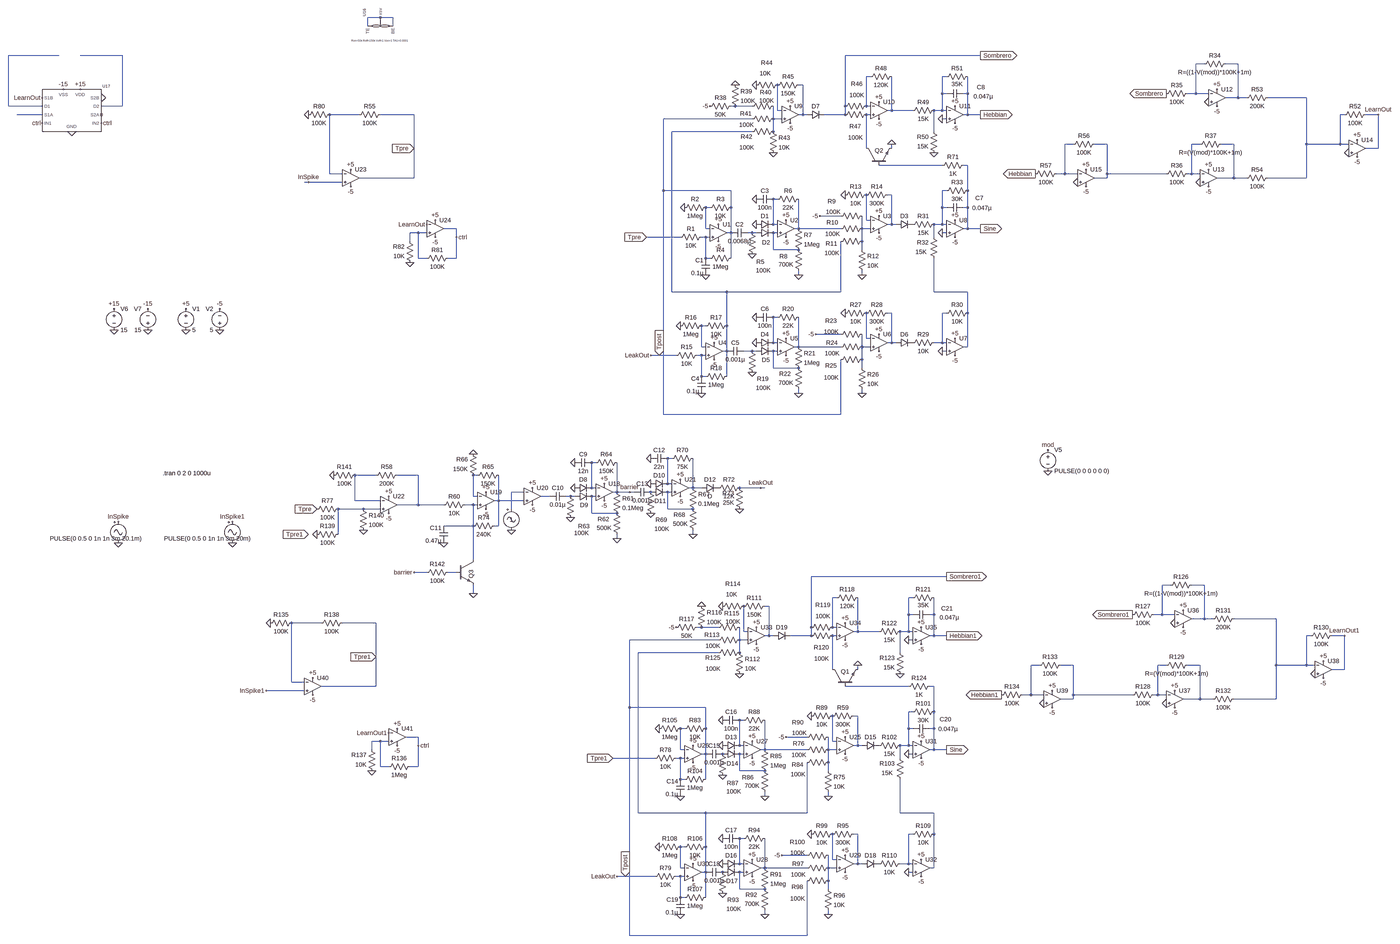
[diagram p0: schematic combined_schematicV2.asc, whole sheet]
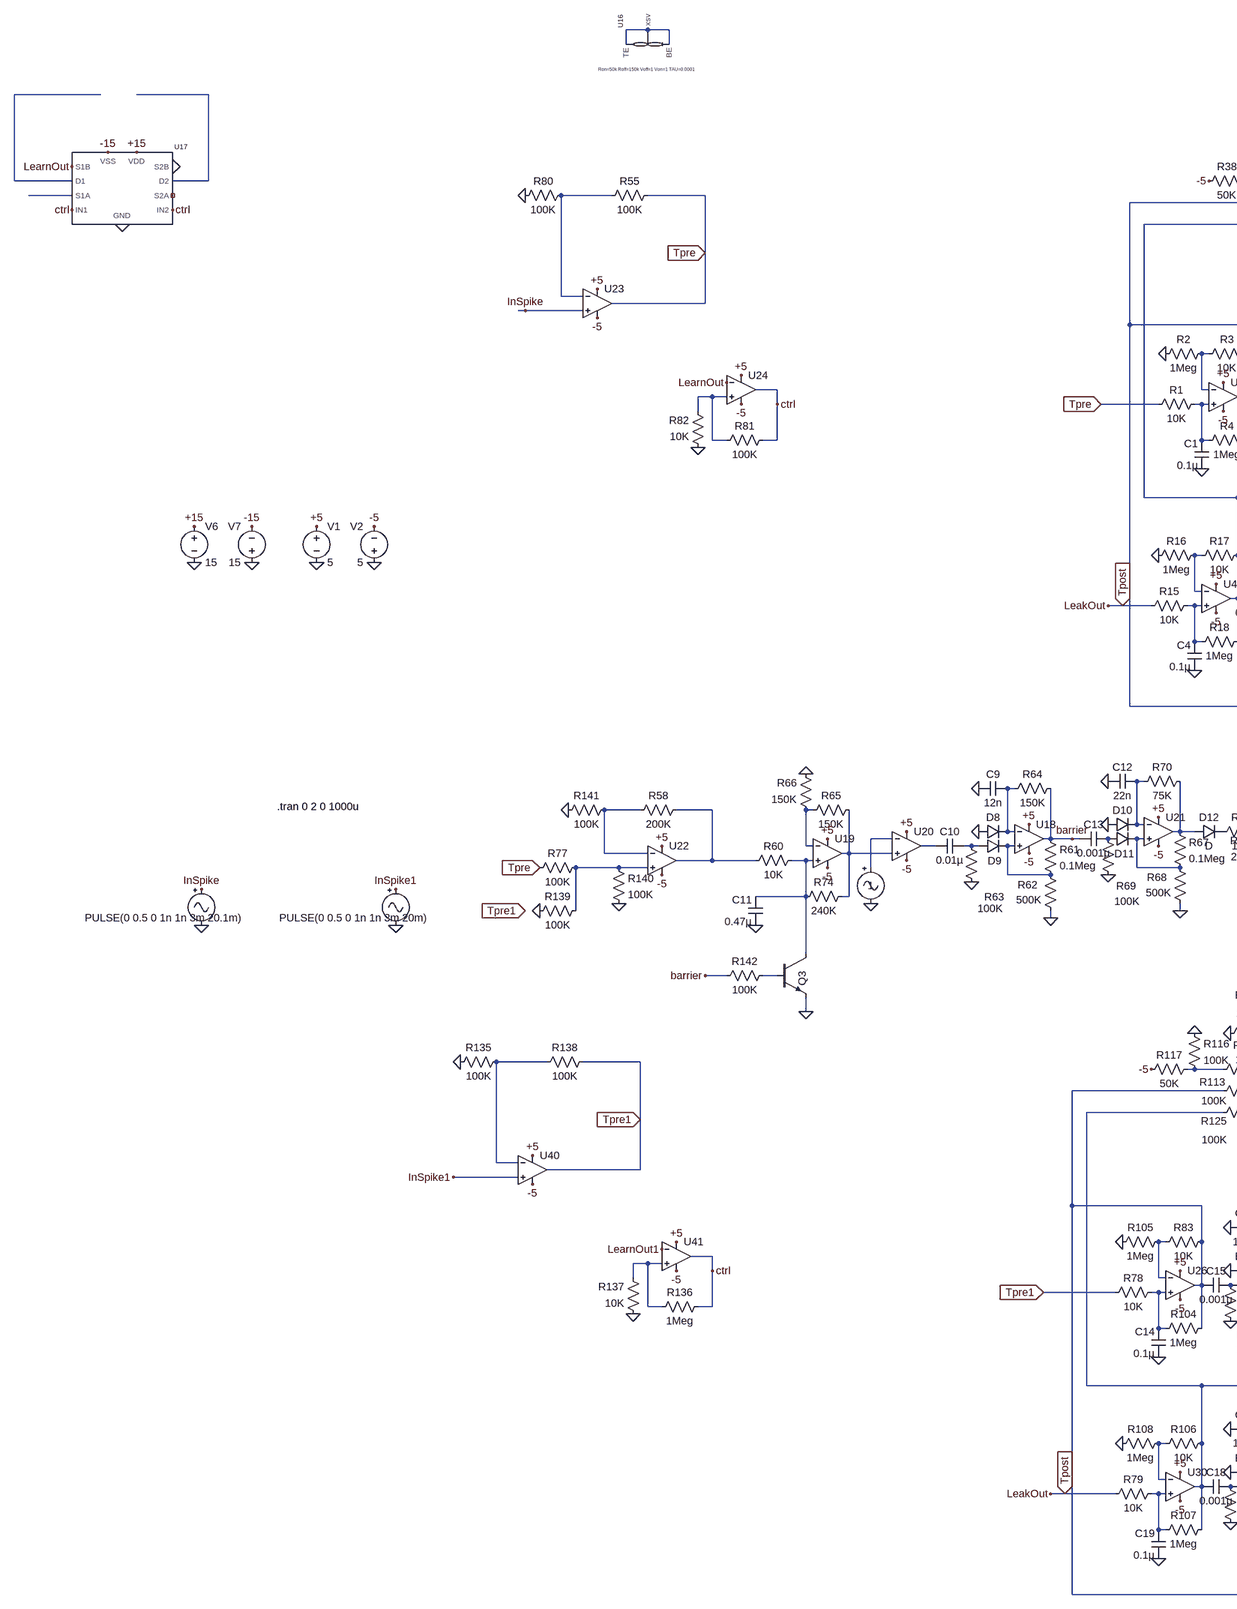
[diagram p1: schematic combined_schematicV2.asc, part, row 1 of 1, column 1 of 2]
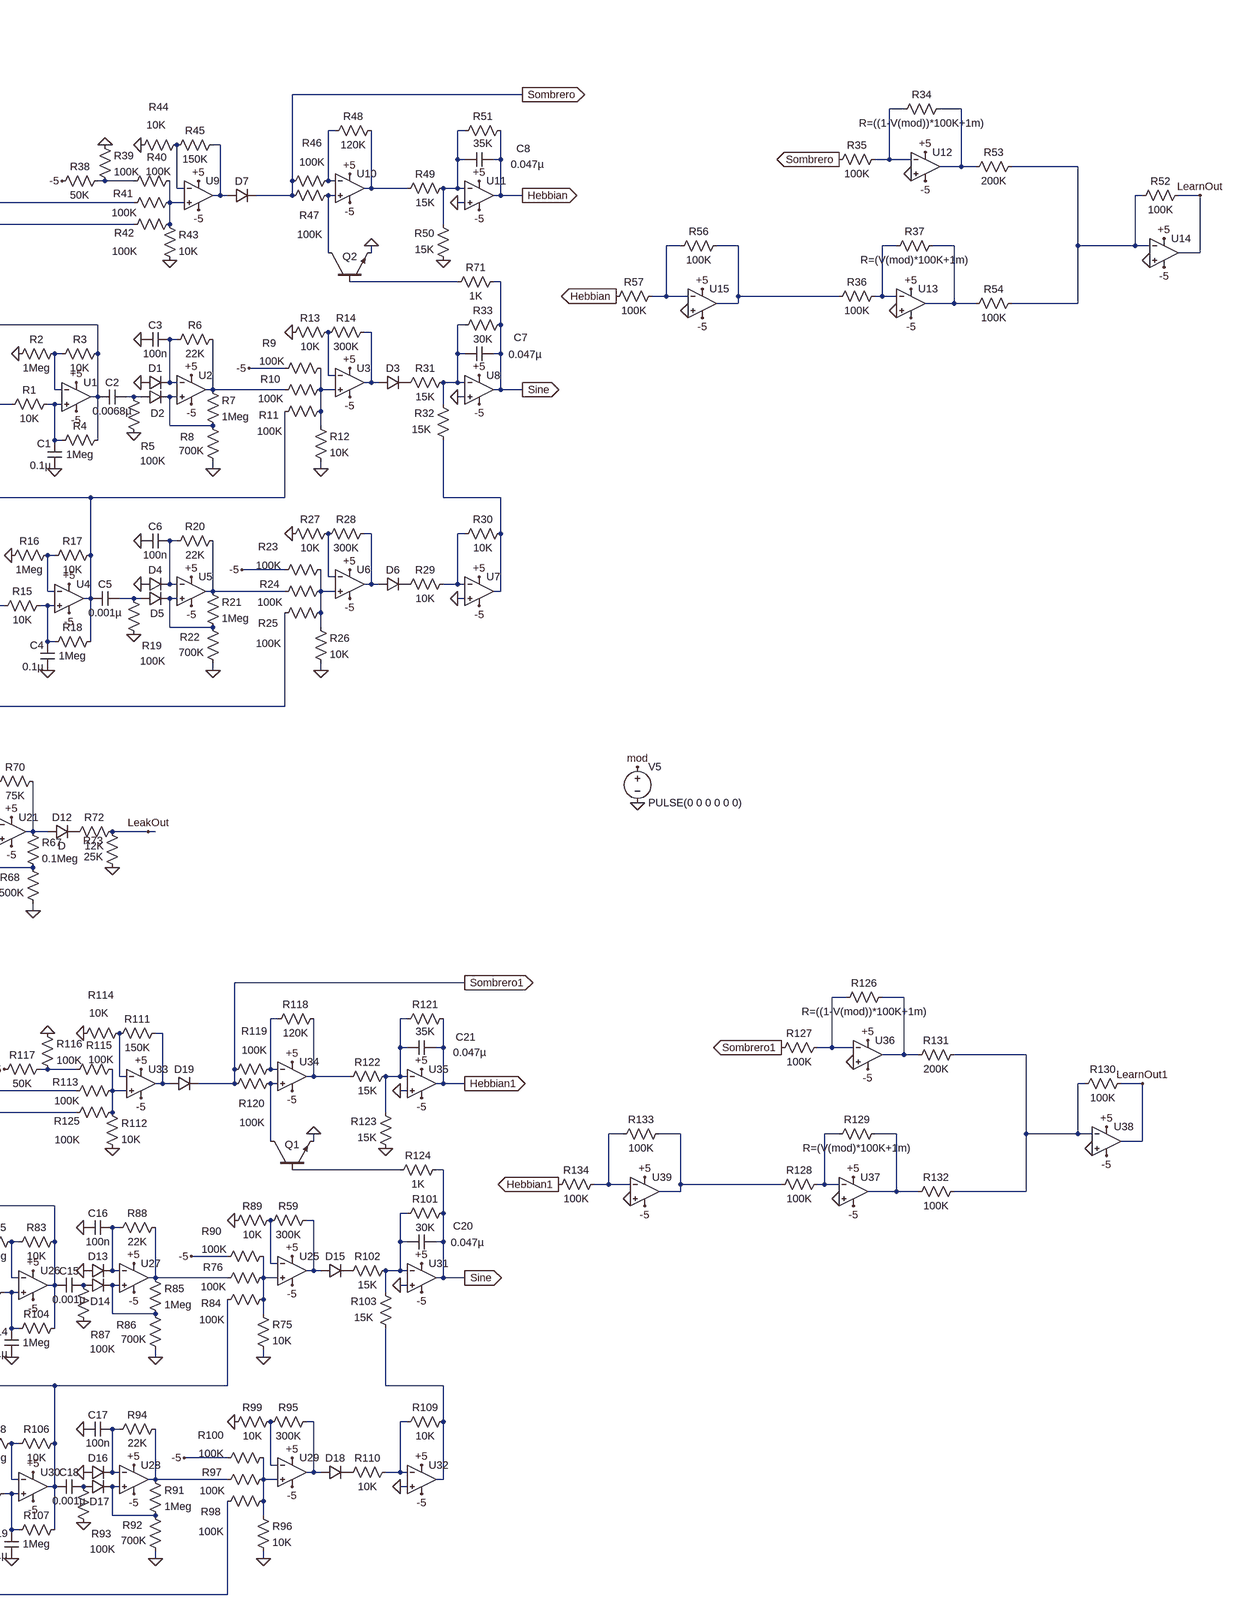
[diagram p2: schematic combined_schematicV2.asc, part, row 1 of 1, column 2 of 2]
combined_schematicV2.asc, the LTspice schematic file:
Version 4
SHEET 1 2784 2788
WIRE -1088 -816 -1136 -816
WIRE -1040 -816 -1088 -816
WIRE -1136 -784 -1136 -816
WIRE -1040 -784 -1040 -816
WIRE -2304 -672 -2496 -672
WIRE -2064 -672 -2224 -672
WIRE 1184 -672 672 -672
WIRE 2032 -640 2000 -640
WIRE 2160 -640 2112 -640
WIRE 768 -592 752 -592
WIRE 1056 -592 1040 -592
WIRE 512 -560 496 -560
WIRE 1040 -528 1040 -592
WIRE 1056 -528 1040 -528
WIRE 1136 -528 1136 -592
WIRE 1136 -528 1120 -528
WIRE 2000 -528 2000 -640
WIRE 2000 -528 1968 -528
WIRE 2048 -528 2000 -528
WIRE 2160 -512 2160 -640
WIRE 2160 -512 2112 -512
WIRE 2192 -512 2160 -512
WIRE 2432 -512 2272 -512
WIRE -2496 -480 -2496 -672
WIRE -2368 -480 -2496 -480
WIRE -2064 -480 -2064 -672
WIRE -2064 -480 -2144 -480
WIRE 256 -480 240 -480
WIRE 320 -480 256 -480
WIRE 672 -480 672 -672
WIRE 752 -480 752 -592
WIRE 768 -480 752 -480
WIRE 416 -464 416 -560
WIRE 432 -464 416 -464
WIRE 848 -464 848 -592
WIRE 848 -464 832 -464
WIRE 928 -464 848 -464
WIRE 1040 -464 1040 -528
WIRE 1040 -464 1008 -464
WIRE 1056 -464 1040 -464
WIRE -2368 -448 -2464 -448
WIRE -1168 -448 -1280 -448
WIRE -960 -448 -1088 -448
WIRE 512 -448 512 -560
WIRE 512 -448 496 -448
WIRE 528 -448 512 -448
WIRE 672 -448 672 -480
WIRE 672 -448 592 -448
WIRE 768 -448 752 -448
WIRE 1136 -448 1136 -528
WIRE 1136 -448 1120 -448
WIRE 1184 -448 1136 -448
WIRE 2576 -448 2560 -448
WIRE 2704 -448 2656 -448
WIRE 320 -432 -16 -432
WIRE 400 -432 400 -480
WIRE 432 -432 400 -432
WIRE 1056 -432 1040 -432
WIRE 320 -384 16 -384
WIRE 400 -384 400 -432
WIRE 1008 -384 1008 -464
WIRE 1536 -336 1504 -336
WIRE 1664 -336 1616 -336
WIRE 2016 -336 1984 -336
WIRE 2144 -336 2096 -336
WIRE 2432 -336 2432 -512
WIRE 2560 -336 2560 -448
WIRE 2560 -336 2432 -336
WIRE 2592 -336 2560 -336
WIRE -960 -320 -960 -448
WIRE 752 -320 752 -448
WIRE 848 -320 848 -336
WIRE 2704 -320 2704 -448
WIRE 2704 -320 2656 -320
WIRE 1040 -256 800 -256
WIRE 1136 -256 1120 -256
WIRE -1280 -224 -1280 -448
WIRE -1232 -224 -1280 -224
WIRE 1504 -224 1504 -336
WIRE 1504 -224 1472 -224
WIRE 1552 -224 1504 -224
WIRE 1664 -224 1664 -336
WIRE 1888 -224 1664 -224
WIRE 1984 -224 1984 -336
WIRE 1984 -224 1968 -224
WIRE 2016 -224 1984 -224
WIRE -960 -208 -960 -320
WIRE -960 -208 -1168 -208
WIRE 1664 -208 1664 -224
WIRE 1664 -208 1616 -208
WIRE 2144 -208 2144 -336
WIRE 2144 -208 2080 -208
WIRE 2192 -208 2144 -208
WIRE 2432 -208 2432 -336
WIRE 2432 -208 2272 -208
WIRE -1360 -192 -1376 -192
WIRE -1232 -192 -1360 -192
WIRE -16 -160 -16 -432
WIRE 240 -160 -16 -160
WIRE 1056 -160 1040 -160
WIRE 1136 -160 1136 -256
WIRE 848 -144 832 -144
WIRE 416 -128 400 -128
WIRE 160 -96 144 -96
WIRE 240 -96 240 -160
WIRE 1040 -96 1040 -160
WIRE 1056 -96 1040 -96
WIRE 1136 -96 1136 -160
WIRE 1136 -96 1120 -96
WIRE 656 -64 576 -64
WIRE 752 -48 752 -144
WIRE 768 -48 752 -48
WIRE 400 -32 400 -128
WIRE 416 -32 400 -32
WIRE 848 -32 848 -144
WIRE 848 -32 832 -32
WIRE 864 -32 848 -32
WIRE 1040 -32 1040 -96
WIRE 1040 -32 1008 -32
WIRE 1056 -32 1040 -32
WIRE -800 -16 -848 -16
WIRE 144 -16 144 -96
WIRE 160 -16 144 -16
WIRE 496 -16 496 -128
WIRE 496 -16 480 -16
WIRE 656 -16 496 -16
WIRE 736 -16 736 -64
WIRE 768 -16 736 -16
WIRE 1136 -16 1136 -96
WIRE 1136 -16 1120 -16
WIRE 1184 -16 1136 -16
WIRE -944 0 -976 0
WIRE -912 0 -944 0
WIRE 240 0 240 -96
WIRE 240 0 224 0
WIRE 320 0 304 0
WIRE 336 0 320 0
WIRE 416 0 400 0
WIRE 1056 0 1040 0
WIRE -800 16 -800 -16
WIRE 48 16 -80 16
WIRE 144 16 128 16
WIRE 160 16 144 16
WIRE 1008 16 1008 -32
WIRE -976 32 -976 0
WIRE 736 32 736 -16
WIRE 400 64 400 0
WIRE 496 64 400 64
WIRE 736 64 736 32
WIRE -944 96 -944 0
WIRE -912 96 -944 96
WIRE -800 96 -800 16
WIRE -800 96 -832 96
WIRE 144 96 144 16
WIRE 160 96 144 96
WIRE 240 96 240 0
WIRE 496 160 496 144
WIRE 736 160 736 144
WIRE 16 224 16 -384
WIRE 224 224 16 224
WIRE 656 224 656 32
WIRE 656 224 224 224
WIRE 1008 224 1008 96
WIRE 1136 224 1008 224
WIRE 848 304 832 304
WIRE 1056 304 1040 304
WIRE 1136 304 1136 224
WIRE 416 320 400 320
WIRE 144 352 128 352
WIRE 224 352 224 224
WIRE 656 384 560 384
WIRE 752 400 752 304
WIRE 768 400 752 400
WIRE 400 416 400 320
WIRE 416 416 400 416
WIRE 848 416 848 304
WIRE 848 416 832 416
WIRE 864 416 848 416
WIRE 1040 416 1040 304
WIRE 1040 416 1008 416
WIRE 1056 416 1040 416
WIRE 128 432 128 352
WIRE 144 432 128 432
WIRE 496 432 496 320
WIRE 496 432 480 432
WIRE 656 432 496 432
WIRE 736 432 736 384
WIRE 768 432 736 432
WIRE 1136 432 1136 304
WIRE 1136 432 1120 432
WIRE 224 448 224 352
WIRE 224 448 208 448
WIRE 320 448 288 448
WIRE 336 448 320 448
WIRE 416 448 400 448
WIRE 1056 448 1040 448
WIRE -32 464 -64 464
WIRE 32 464 -32 464
WIRE 128 464 112 464
WIRE 144 464 128 464
WIRE 736 480 736 432
WIRE 400 512 400 448
WIRE 496 512 400 512
WIRE 736 512 736 480
WIRE 128 544 128 464
WIRE 144 544 128 544
WIRE 224 544 224 448
WIRE 496 608 496 592
WIRE 736 608 736 592
WIRE -16 688 -16 -160
WIRE 656 688 656 480
WIRE 656 688 -16 688
WIRE 16 976 0 976
WIRE -272 992 -288 992
WIRE -1104 1040 -1184 1040
WIRE -944 1040 -1024 1040
WIRE -720 1040 -736 1040
WIRE 0 1072 0 976
WIRE 16 1072 0 1072
WIRE -288 1088 -288 992
WIRE -272 1088 -288 1088
WIRE 96 1088 96 976
WIRE 96 1088 80 1088
WIRE 128 1088 96 1088
WIRE 352 1088 272 1088
WIRE 368 1088 352 1088
WIRE -544 1104 -592 1104
WIRE -192 1104 -192 992
WIRE -192 1104 -208 1104
WIRE -144 1104 -192 1104
WIRE -128 1104 -144 1104
WIRE 16 1104 0 1104
WIRE -736 1120 -736 1040
WIRE -720 1120 -736 1120
WIRE -448 1120 -480 1120
WIRE -368 1120 -384 1120
WIRE -352 1120 -368 1120
WIRE -272 1120 -288 1120
WIRE -1184 1136 -1184 1040
WIRE -1088 1136 -1184 1136
WIRE -640 1136 -640 1040
WIRE -640 1136 -656 1136
WIRE -544 1136 -640 1136
WIRE -944 1152 -944 1040
WIRE -944 1152 -1024 1152
WIRE -848 1152 -944 1152
WIRE -736 1152 -768 1152
WIRE -720 1152 -736 1152
WIRE -1152 1168 -1248 1168
WIRE -1088 1168 -1152 1168
WIRE -592 1168 -592 1104
WIRE 0 1168 0 1104
WIRE 96 1168 0 1168
WIRE -288 1184 -288 1120
WIRE -192 1184 -288 1184
WIRE -736 1232 -736 1152
WIRE -736 1232 -848 1232
WIRE -640 1232 -640 1136
WIRE -640 1232 -656 1232
WIRE -1248 1264 -1248 1168
WIRE 96 1264 96 1248
WIRE -192 1280 -192 1264
WIRE -736 1360 -736 1232
WIRE -912 1408 -960 1408
WIRE -800 1408 -832 1408
WIRE 1056 1424 544 1424
WIRE 1904 1456 1872 1456
WIRE 2032 1456 1984 1456
WIRE -736 1488 -736 1456
WIRE 640 1504 624 1504
WIRE 928 1504 912 1504
WIRE 384 1536 368 1536
WIRE 912 1568 912 1504
WIRE 928 1568 912 1568
WIRE 1008 1568 1008 1504
WIRE 1008 1568 992 1568
WIRE 1872 1568 1872 1456
WIRE 1872 1568 1840 1568
WIRE 1920 1568 1872 1568
WIRE 2032 1584 2032 1456
WIRE 2032 1584 1984 1584
WIRE 2064 1584 2032 1584
WIRE 2304 1584 2144 1584
WIRE -1312 1600 -1424 1600
WIRE -1104 1600 -1232 1600
WIRE 128 1616 112 1616
WIRE 192 1616 128 1616
WIRE 544 1616 544 1424
WIRE 624 1616 624 1504
WIRE 640 1616 624 1616
WIRE 288 1632 288 1536
WIRE 304 1632 288 1632
WIRE 720 1632 720 1504
WIRE 720 1632 704 1632
WIRE 800 1632 720 1632
WIRE 912 1632 912 1568
WIRE 912 1632 880 1632
WIRE 928 1632 912 1632
WIRE 384 1648 384 1536
WIRE 384 1648 368 1648
WIRE 400 1648 384 1648
WIRE 544 1648 544 1616
WIRE 544 1648 464 1648
WIRE 640 1648 624 1648
WIRE 1008 1648 1008 1568
WIRE 1008 1648 992 1648
WIRE 1056 1648 1008 1648
WIRE 2448 1648 2432 1648
WIRE 2576 1648 2528 1648
WIRE 192 1664 -144 1664
WIRE 272 1664 272 1616
WIRE 304 1664 272 1664
WIRE 928 1664 912 1664
WIRE 192 1712 -112 1712
WIRE 272 1712 272 1664
WIRE 880 1712 880 1632
WIRE -1104 1728 -1104 1600
WIRE 1408 1760 1376 1760
WIRE 1536 1760 1488 1760
WIRE 1888 1760 1856 1760
WIRE 2016 1760 1968 1760
WIRE 2304 1760 2304 1584
WIRE 2432 1760 2432 1648
WIRE 2432 1760 2304 1760
WIRE 2464 1760 2432 1760
WIRE 624 1776 624 1648
WIRE 720 1776 720 1760
WIRE 2576 1776 2576 1648
WIRE 2576 1776 2528 1776
WIRE -1424 1824 -1424 1600
WIRE -1376 1824 -1424 1824
WIRE -1104 1840 -1104 1728
WIRE -1104 1840 -1312 1840
WIRE 912 1840 672 1840
WIRE 1008 1840 992 1840
WIRE -1376 1856 -1520 1856
WIRE 1376 1872 1376 1760
WIRE 1376 1872 1344 1872
WIRE 1424 1872 1376 1872
WIRE 1536 1872 1536 1760
WIRE 1760 1872 1536 1872
WIRE 1856 1872 1856 1760
WIRE 1856 1872 1840 1872
WIRE 1888 1872 1856 1872
WIRE 1536 1888 1536 1872
WIRE 1536 1888 1488 1888
WIRE 2016 1888 2016 1760
WIRE 2016 1888 1952 1888
WIRE 2064 1888 2016 1888
WIRE 2304 1888 2304 1760
WIRE 2304 1888 2144 1888
WIRE -144 1920 -144 1664
WIRE 144 1920 -144 1920
WIRE 928 1936 912 1936
WIRE 1008 1936 1008 1840
WIRE 720 1952 704 1952
WIRE 288 1968 272 1968
WIRE 64 2000 48 2000
WIRE 144 2000 144 1920
WIRE 912 2000 912 1936
WIRE 928 2000 912 2000
WIRE 1008 2000 1008 1936
WIRE 1008 2000 992 2000
WIRE -944 2032 -992 2032
WIRE 528 2032 448 2032
WIRE -1088 2048 -1120 2048
WIRE -1056 2048 -1088 2048
WIRE 624 2048 624 1952
WIRE 640 2048 624 2048
WIRE -944 2064 -944 2032
WIRE 272 2064 272 1968
WIRE 288 2064 272 2064
WIRE 720 2064 720 1952
WIRE 720 2064 704 2064
WIRE 736 2064 720 2064
WIRE 912 2064 912 2000
WIRE 912 2064 880 2064
WIRE 928 2064 912 2064
WIRE -1120 2080 -1120 2048
WIRE 48 2080 48 2000
WIRE 64 2080 48 2080
WIRE 368 2080 368 1968
WIRE 368 2080 352 2080
WIRE 528 2080 368 2080
WIRE 608 2080 608 2032
WIRE 640 2080 608 2080
WIRE 1008 2080 1008 2000
WIRE 1008 2080 992 2080
WIRE 1056 2080 1008 2080
WIRE 144 2096 144 2000
WIRE 144 2096 128 2096
WIRE 288 2096 272 2096
WIRE 928 2096 912 2096
WIRE -48 2112 -208 2112
WIRE 48 2112 32 2112
WIRE 64 2112 48 2112
WIRE 880 2112 880 2064
WIRE 608 2128 608 2080
WIRE -1088 2144 -1088 2048
WIRE -1056 2144 -1088 2144
WIRE -944 2144 -944 2064
WIRE -944 2144 -976 2144
WIRE 272 2160 272 2096
WIRE 368 2160 272 2160
WIRE 608 2160 608 2128
WIRE 48 2192 48 2112
WIRE 64 2192 48 2192
WIRE 144 2192 144 2096
WIRE 368 2256 368 2240
WIRE 608 2256 608 2240
WIRE -112 2320 -112 1712
WIRE 144 2320 -112 2320
WIRE 528 2320 528 2128
WIRE 528 2320 144 2320
WIRE 880 2320 880 2192
WIRE 1008 2320 880 2320
WIRE 720 2400 704 2400
WIRE 928 2400 912 2400
WIRE 1008 2400 1008 2320
WIRE 288 2416 272 2416
WIRE 64 2448 48 2448
WIRE 144 2448 144 2320
WIRE 528 2480 432 2480
WIRE 624 2496 624 2400
WIRE 640 2496 624 2496
WIRE 272 2512 272 2416
WIRE 288 2512 272 2512
WIRE 720 2512 720 2400
WIRE 720 2512 704 2512
WIRE 736 2512 720 2512
WIRE 912 2512 912 2400
WIRE 912 2512 880 2512
WIRE 928 2512 912 2512
WIRE 48 2528 48 2448
WIRE 64 2528 48 2528
WIRE 368 2528 368 2416
WIRE 368 2528 352 2528
WIRE 528 2528 368 2528
WIRE 608 2528 608 2480
WIRE 640 2528 608 2528
WIRE 1008 2528 1008 2400
WIRE 1008 2528 992 2528
WIRE 144 2544 144 2448
WIRE 144 2544 128 2544
WIRE 288 2544 272 2544
WIRE 928 2544 912 2544
WIRE -160 2560 -192 2560
WIRE -48 2560 -160 2560
WIRE 48 2560 32 2560
WIRE 64 2560 48 2560
WIRE 608 2576 608 2528
WIRE 272 2608 272 2544
WIRE 368 2608 272 2608
WIRE 608 2608 608 2576
WIRE 48 2640 48 2560
WIRE 64 2640 48 2640
WIRE 144 2640 144 2544
WIRE 368 2704 368 2688
WIRE 608 2704 608 2688
WIRE -144 2784 -144 1920
WIRE 528 2784 528 2576
WIRE 528 2784 -144 2784
FLAG 800 -64 +5
FLAG 800 0 -5
FLAG 192 -32 +5
FLAG 192 32 -5
FLAG 448 -48 +5
FLAG 448 16 -5
FLAG 336 -32 0
FLAG 336 -128 0
FLAG 320 80 0
FLAG 672 -144 0
FLAG 576 -64 -5
FLAG 448 400 +5
FLAG 448 464 -5
FLAG 336 416 0
FLAG 336 320 0
FLAG 320 528 0
FLAG 496 608 0
FLAG 496 160 0
FLAG 800 384 +5
FLAG 800 448 -5
FLAG 672 304 0
FLAG 560 384 -5
FLAG 144 160 0
FLAG 64 -96 0
FLAG 176 416 +5
FLAG 176 480 -5
FLAG 128 608 0
FLAG 48 352 0
FLAG 1088 -48 +5
FLAG 1088 16 -5
FLAG 1088 400 +5
FLAG 1088 464 -5
FLAG 1040 448 0
FLAG 1040 0 0
FLAG 736 160 0
FLAG 736 608 0
FLAG 1184 -16 Sine
IOPIN 1184 -16 Out
FLAG 464 -480 +5
FLAG 464 -416 -5
FLAG 336 -560 0
FLAG 256 -560 0
FLAG 800 -496 +5
FLAG 800 -432 -5
FLAG 160 -480 -5
FLAG 1088 -480 +5
FLAG 1088 -416 -5
FLAG 1040 -432 0
FLAG 1008 -304 0
FLAG 848 -336 0
FLAG 1184 -448 Hebbian
IOPIN 1184 -448 Out
FLAG 1184 -672 Sombrero
IOPIN 1184 -672 Out
FLAG -1824 368 0
FLAG -1696 368 0
FLAG -1696 288 -5
FLAG -1824 288 +5
FLAG -32 464 Tpost
IOPIN -32 464 In
FLAG -80 16 Tpre
IOPIN -80 16 In
FLAG 400 -304 0
FLAG 2048 -240 +5
FLAG 2048 -176 -5
FLAG 2080 -544 +5
FLAG 2080 -480 -5
FLAG 2048 -496 0
FLAG 2016 -192 0
FLAG 2624 -352 +5
FLAG 2624 -288 -5
FLAG 2592 -304 0
FLAG 1888 -528 Sombrero
IOPIN 1888 -528 Out
FLAG 1392 -224 Hebbian
IOPIN 1392 -224 Out
FLAG 1440 1024 0
FLAG 1440 944 mod
FLAG 2704 -448 LearnOut
FLAG 1584 -240 +5
FLAG 1584 -176 -5
FLAG 1552 -192 0
FLAG -2256 -384 0
FLAG -2080 1296 0
FLAG -240 1072 +5
FLAG -240 1136 -5
FLAG -352 1088 0
FLAG -352 992 0
FLAG -368 1200 0
FLAG -192 1280 0
FLAG -688 1104 +5
FLAG -688 1168 -5
FLAG -848 1296 0
FLAG -736 960 0
FLAG -512 1088 +5
FLAG -512 1152 -5
FLAG 48 1056 +5
FLAG 48 1120 -5
FLAG -64 1072 0
FLAG -64 976 0
FLAG -64 1184 0
FLAG 96 1264 0
FLAG 272 1168 0
FLAG -592 1248 0
FLAG -2096 368 0
FLAG -1968 368 0
FLAG -1968 288 -15
FLAG -2096 288 +15
FLAG -2224 -544 +15
FLAG -2288 -544 -15
FLAG 352 1088 LeakOut
FLAG -64 464 LeakOut
FLAG -1200 -240 +5
FLAG -1200 -176 -5
FLAG -1360 -192 InSpike
FLAG -1360 -448 0
FLAG -960 -320 Tpre
IOPIN -960 -320 In
FLAG -2144 -512 0
FLAG -1328 1168 Tpre
IOPIN -1328 1168 In
FLAG -2080 1216 InSpike
FLAG -2368 -512 LearnOut
FLAG -880 -48 +5
FLAG -912 -32 LearnOut
FLAG -976 112 0
FLAG -800 16 ctrl
FLAG -2368 -416 ctrl
FLAG -2144 -416 ctrl
FLAG -880 16 -5
FLAG -1056 1120 +5
FLAG -1056 1184 -5
FLAG -1264 1040 0
FLAG 672 2032 +5
FLAG 672 2096 -5
FLAG 96 2064 +5
FLAG 96 2128 -5
FLAG 320 2048 +5
FLAG 320 2112 -5
FLAG 208 2064 0
FLAG 208 1968 0
FLAG 208 2176 0
FLAG 544 1952 0
FLAG 448 2032 -5
FLAG 320 2496 +5
FLAG 320 2560 -5
FLAG 208 2512 0
FLAG 208 2416 0
FLAG 208 2624 0
FLAG 368 2704 0
FLAG 368 2256 0
FLAG 672 2480 +5
FLAG 672 2544 -5
FLAG 544 2400 0
FLAG 432 2480 -5
FLAG 48 2256 0
FLAG -32 2000 0
FLAG 96 2512 +5
FLAG 96 2576 -5
FLAG 48 2704 0
FLAG -32 2448 0
FLAG 960 2048 +5
FLAG 960 2112 -5
FLAG 960 2496 +5
FLAG 960 2560 -5
FLAG 912 2544 0
FLAG 912 2096 0
FLAG 608 2256 0
FLAG 608 2704 0
FLAG 1056 2080 Sine
IOPIN 1056 2080 Out
FLAG 336 1616 +5
FLAG 336 1680 -5
FLAG 208 1536 0
FLAG 128 1536 0
FLAG 672 1600 +5
FLAG 672 1664 -5
FLAG 32 1616 -5
FLAG 960 1616 +5
FLAG 960 1680 -5
FLAG 912 1664 0
FLAG 880 1792 0
FLAG 720 1760 0
FLAG 1056 1648 Hebbian1
IOPIN 1056 1648 Out
FLAG 1056 1424 Sombrero1
IOPIN 1056 1424 Out
FLAG -160 2560 Tpost
IOPIN -160 2560 In
FLAG -208 2112 Tpre1
IOPIN -208 2112 In
FLAG 272 1792 0
FLAG 1920 1856 +5
FLAG 1920 1920 -5
FLAG 1952 1552 +5
FLAG 1952 1616 -5
FLAG 1920 1600 0
FLAG 1888 1904 0
FLAG 2496 1744 +5
FLAG 2496 1808 -5
FLAG 2464 1792 0
FLAG 1760 1568 Sombrero1
IOPIN 1760 1568 Out
FLAG 1264 1872 Hebbian1
IOPIN 1264 1872 Out
FLAG 2576 1648 LearnOut1
FLAG 1456 1856 +5
FLAG 1456 1920 -5
FLAG 1424 1904 0
FLAG -192 2560 LeakOut
FLAG -1648 1296 0
FLAG -1344 1808 +5
FLAG -1344 1872 -5
FLAG -1520 1856 InSpike1
FLAG -1504 1600 0
FLAG -1104 1728 Tpre1
IOPIN -1104 1728 In
FLAG -1648 1216 InSpike1
FLAG -1024 2000 +5
FLAG -1056 2016 LearnOut1
FLAG -1120 2160 0
FLAG -944 2064 ctrl
FLAG -1024 2064 -5
FLAG -1360 1264 Tpre1
IOPIN -1360 1264 In
FLAG -1152 1248 0
FLAG -736 1488 0
FLAG -144 1104 barrier
FLAG -960 1408 barrier
FLAG -1328 1264 0
SYMBOL Opamps\\UniversalOpamp2 800 -32 R0
SYMATTR InstName U3
SYMBOL res 848 -160 R90
WINDOW 0 0 56 VBottom 2
WINDOW 3 32 56 VTop 2
SYMATTR InstName R14
SYMATTR Value 300K
SYMBOL res 720 48 R0
SYMATTR InstName R12
SYMATTR Value 10K
SYMBOL res 752 -32 R90
WINDOW 0 8 128 VBottom 2
WINDOW 3 20 127 VTop 2
SYMATTR InstName R10
SYMATTR Value 100K
SYMBOL Opamps\\UniversalOpamp2 192 0 R0
SYMATTR InstName U1
SYMBOL cap 160 160 R180
WINDOW 0 24 56 Left 2
WINDOW 3 24 8 Left 2
SYMATTR InstName C1
SYMATTR Value 0.1µ
SYMBOL res 144 0 R90
WINDOW 0 0 56 VBottom 2
WINDOW 3 32 56 VTop 2
SYMATTR InstName R1
SYMATTR Value 10K
SYMBOL res 128 448 R90
WINDOW 0 0 56 VBottom 2
WINDOW 3 32 56 VTop 2
SYMATTR InstName R15
SYMATTR Value 10K
SYMBOL res 256 -112 R90
WINDOW 0 0 56 VBottom 2
WINDOW 3 32 56 VTop 2
SYMATTR InstName R3
SYMATTR Value 10K
SYMBOL res 752 16 R90
WINDOW 0 40 132 VBottom 2
WINDOW 3 45 130 VTop 2
SYMATTR InstName R11
SYMATTR Value 100K
SYMBOL Opamps\\UniversalOpamp2 448 -16 R0
SYMATTR InstName U2
SYMBOL diode 336 -16 R270
WINDOW 0 32 32 VTop 2
WINDOW 3 0 32 Invisible 2
SYMATTR InstName D1
SYMBOL diode 336 16 R270
WINDOW 0 -36 37 VTop 2
WINDOW 3 0 32 Invisible 2
SYMATTR InstName D2
SYMBOL res 480 -32 R0
SYMATTR InstName R7
SYMATTR Value 1Meg
SYMBOL res 512 160 R180
WINDOW 0 58 71 Left 2
WINDOW 3 36 40 Left 2
SYMATTR InstName R8
SYMATTR Value 700K
SYMBOL res 304 -16 R0
WINDOW 0 32 126 Left 2
WINDOW 3 30 158 Left 2
SYMATTR InstName R5
SYMATTR Value 100K
SYMBOL cap 304 -16 R90
WINDOW 0 0 32 VBottom 2
WINDOW 3 32 32 VTop 2
SYMATTR InstName C2
SYMATTR Value 0.0068µ
SYMBOL res 512 -144 R90
WINDOW 0 0 56 VBottom 2
WINDOW 3 32 56 VTop 2
SYMATTR InstName R6
SYMATTR Value 22K
SYMBOL cap 400 -144 R90
WINDOW 0 0 32 VBottom 2
WINDOW 3 32 32 VTop 2
SYMATTR InstName C3
SYMATTR Value 100n
SYMBOL res 656 -128 R270
WINDOW 0 32 56 VTop 2
WINDOW 3 0 56 VBottom 2
SYMATTR InstName R13
SYMATTR Value 10K
SYMBOL diode 864 -16 R270
WINDOW 0 32 32 VTop 2
WINDOW 3 0 32 Invisible 2
SYMATTR InstName D3
SYMBOL res 752 -80 R90
WINDOW 0 -24 131 VBottom 2
WINDOW 3 -15 125 VTop 2
SYMATTR InstName R9
SYMATTR Value 100K
SYMBOL Opamps\\UniversalOpamp2 448 432 R0
SYMATTR InstName U5
SYMBOL diode 336 432 R270
WINDOW 0 32 32 VTop 2
WINDOW 3 0 32 Invisible 2
SYMATTR InstName D4
SYMBOL diode 336 464 R270
WINDOW 0 -33 36 VTop 2
WINDOW 3 0 32 Invisible 2
SYMATTR InstName D5
SYMBOL res 480 416 R0
SYMATTR InstName R21
SYMATTR Value 1Meg
SYMBOL res 512 608 R180
WINDOW 0 45 74 Left 2
WINDOW 3 36 40 Left 2
SYMATTR InstName R22
SYMATTR Value 700K
SYMBOL res 304 432 R0
WINDOW 0 34 121 Left 2
WINDOW 3 30 155 Left 2
SYMATTR InstName R19
SYMATTR Value 100K
SYMBOL res 512 304 R90
WINDOW 0 0 56 VBottom 2
WINDOW 3 32 56 VTop 2
SYMATTR InstName R20
SYMATTR Value 22K
SYMBOL cap 400 304 R90
WINDOW 0 0 32 VBottom 2
WINDOW 3 32 32 VTop 2
SYMATTR InstName C6
SYMATTR Value 100n
SYMBOL cap 288 432 R90
WINDOW 0 0 32 VBottom 2
WINDOW 3 32 32 VTop 2
SYMATTR InstName C5
SYMATTR Value 0.001µ
SYMBOL Opamps\\UniversalOpamp2 800 416 R0
SYMATTR InstName U6
SYMBOL res 848 288 R90
WINDOW 0 0 56 VBottom 2
WINDOW 3 32 56 VTop 2
SYMATTR InstName R28
SYMATTR Value 300K
SYMBOL res 720 496 R0
SYMATTR InstName R26
SYMATTR Value 10K
SYMBOL res 752 416 R90
WINDOW 0 16 130 VBottom 2
WINDOW 3 25 129 VTop 2
SYMATTR InstName R24
SYMATTR Value 100K
SYMBOL res 752 464 R90
WINDOW 0 55 133 VBottom 2
WINDOW 3 68 132 VTop 2
SYMATTR InstName R25
SYMATTR Value 100K
SYMBOL res 656 320 R270
WINDOW 0 32 56 VTop 2
WINDOW 3 0 56 VBottom 2
SYMATTR InstName R27
SYMATTR Value 10K
SYMBOL diode 864 432 R270
WINDOW 0 32 32 VTop 2
WINDOW 3 0 32 Invisible 2
SYMATTR InstName D6
SYMBOL res 752 368 R90
WINDOW 0 -19 133 VBottom 2
WINDOW 3 -9 132 VTop 2
SYMATTR InstName R23
SYMATTR Value 100K
SYMBOL res 1152 -176 R90
WINDOW 0 0 56 VBottom 2
WINDOW 3 32 56 VTop 2
SYMATTR InstName R33
SYMATTR Value 30K
SYMBOL res 1024 -48 R90
WINDOW 0 0 56 VBottom 2
WINDOW 3 32 56 VTop 2
SYMATTR InstName R31
SYMATTR Value 15K
SYMBOL res 1024 112 R180
WINDOW 0 36 76 Left 2
WINDOW 3 43 40 Left 2
SYMATTR InstName R32
SYMATTR Value 15K
SYMBOL res 256 80 R90
WINDOW 0 0 56 VBottom 2
WINDOW 3 32 56 VTop 2
SYMATTR InstName R4
SYMATTR Value 1Meg
SYMBOL res 160 -112 R90
WINDOW 0 0 56 VBottom 2
WINDOW 3 32 56 VTop 2
SYMATTR InstName R2
SYMATTR Value 1Meg
SYMBOL Opamps\\UniversalOpamp2 176 448 R0
SYMATTR InstName U4
SYMBOL cap 144 608 R180
WINDOW 0 24 56 Left 2
WINDOW 3 24 8 Left 2
SYMATTR InstName C4
SYMATTR Value 0.1µ
SYMBOL res 240 336 R90
WINDOW 0 0 56 VBottom 2
WINDOW 3 32 56 VTop 2
SYMATTR InstName R17
SYMATTR Value 10K
SYMBOL res 240 528 R90
WINDOW 0 0 56 VBottom 2
WINDOW 3 32 56 VTop 2
SYMATTR InstName R18
SYMATTR Value 1Meg
SYMBOL res 144 336 R90
WINDOW 0 0 56 VBottom 2
WINDOW 3 32 56 VTop 2
SYMATTR InstName R16
SYMATTR Value 1Meg
SYMBOL Opamps\\UniversalOpamp2 1088 -16 R0
SYMATTR InstName U8
SYMBOL res 1152 288 R90
WINDOW 0 0 56 VBottom 2
WINDOW 3 32 56 VTop 2
SYMATTR InstName R30
SYMATTR Value 10K
SYMBOL Opamps\\UniversalOpamp2 1088 432 R0
SYMATTR InstName U7
SYMBOL res 1024 400 R90
WINDOW 0 0 56 VBottom 2
WINDOW 3 32 56 VTop 2
SYMATTR InstName R29
SYMATTR Value 10K
SYMBOL cap 1120 -112 R90
WINDOW 0 -4 -60 VBottom 2
WINDOW 3 2 -70 VTop 2
SYMATTR InstName C7
SYMATTR Value 0.047µ
SYMBOL Opamps\\UniversalOpamp2 464 -448 R0
SYMATTR InstName U9
SYMBOL res 512 -576 R90
WINDOW 0 0 56 VBottom 2
WINDOW 3 32 56 VTop 2
SYMATTR InstName R45
SYMATTR Value 150K
SYMBOL res 384 -400 R0
SYMATTR InstName R43
SYMATTR Value 10K
SYMBOL res 416 -448 R90
WINDOW 0 12 120 VBottom 2
WINDOW 3 23 117 VTop 2
SYMATTR InstName R41
SYMATTR Value 100K
SYMBOL res 320 -544 R270
WINDOW 0 85 55 VTop 2
WINDOW 3 76 50 VBottom 2
SYMATTR InstName R44
SYMATTR Value 10K
SYMBOL res 416 -496 R90
WINDOW 0 -21 45 VBottom 2
WINDOW 3 -21 41 VTop 2
SYMATTR InstName R40
SYMATTR Value 100K
SYMBOL res 240 -576 R0
SYMATTR InstName R39
SYMATTR Value 100K
SYMBOL res 256 -496 R90
WINDOW 0 0 56 VBottom 2
WINDOW 3 32 56 VTop 2
SYMATTR InstName R38
SYMATTR Value 50K
SYMBOL diode 528 -432 R270
WINDOW 0 32 32 VTop 2
WINDOW 3 0 32 Invisible 2
SYMATTR InstName D7
SYMBOL res 864 -608 R90
WINDOW 0 0 56 VBottom 2
WINDOW 3 32 56 VTop 2
SYMATTR InstName R48
SYMATTR Value 120K
SYMBOL Opamps\\UniversalOpamp2 800 -464 R0
SYMATTR InstName U10
SYMBOL res 768 -496 R90
WINDOW 0 -53 52 VBottom 2
WINDOW 3 -42 52 VTop 2
SYMATTR InstName R46
SYMATTR Value 100K
SYMBOL res 768 -464 R90
WINDOW 0 76 58 VBottom 2
WINDOW 3 87 57 VTop 2
SYMATTR InstName R47
SYMATTR Value 100K
SYMBOL npn 752 -256 R270
WINDOW 0 56 32 VRight 2
WINDOW 3 56 68 Invisible 2
SYMATTR InstName Q2
SYMBOL res 1152 -608 R90
WINDOW 0 0 56 VBottom 2
WINDOW 3 60 56 VBottom 2
SYMATTR InstName R51
SYMATTR Value 35K
SYMBOL res 1024 -480 R90
WINDOW 0 0 56 VBottom 2
WINDOW 3 32 56 VTop 2
SYMATTR InstName R49
SYMATTR Value 15K
SYMBOL res 1024 -288 R180
WINDOW 0 36 76 Left 2
WINDOW 3 36 40 Left 2
SYMATTR InstName R50
SYMATTR Value 15K
SYMBOL Opamps\\UniversalOpamp2 1088 -448 R0
SYMATTR InstName U11
SYMBOL cap 1120 -544 R90
WINDOW 0 8 -66 VBottom 2
WINDOW 3 11 -75 VTop 2
SYMATTR InstName C8
SYMATTR Value 0.047µ
SYMBOL res 1024 -240 R270
WINDOW 0 32 56 VTop 2
WINDOW 3 0 56 VBottom 2
SYMATTR InstName R71
SYMATTR Value 1K
SYMBOL voltage -1824 272 R0
WINDOW 123 0 0 Left 2
WINDOW 39 0 0 Left 2
SYMATTR InstName V1
SYMATTR Value 5
SYMBOL voltage -1696 384 R180
WINDOW 0 24 96 Left 2
WINDOW 3 24 16 Left 2
WINDOW 123 0 0 Left 2
WINDOW 39 0 0 Left 2
SYMATTR InstName V2
SYMATTR Value 5
SYMBOL res 416 -400 R90
WINDOW 0 51 117 VBottom 2
WINDOW 3 61 116 VTop 2
SYMATTR InstName R42
SYMATTR Value 100K
SYMBOL Opamps\\UniversalOpamp2 2080 -512 R0
SYMATTR InstName U12
SYMBOL Opamps\\UniversalOpamp2 2048 -208 R0
SYMATTR InstName U13
SYMBOL res 2128 -656 R90
WINDOW 0 0 56 VBottom 2
WINDOW 3 32 56 VTop 2
SYMATTR InstName R34
SYMATTR Value R=((1-V(mod))*100K+1m)
SYMBOL res 1984 -544 R90
WINDOW 0 0 56 VBottom 2
WINDOW 3 32 56 VTop 2
SYMATTR InstName R35
SYMATTR Value 100K
SYMBOL res 1984 -240 R90
WINDOW 0 0 56 VBottom 2
WINDOW 3 32 56 VTop 2
SYMATTR InstName R36
SYMATTR Value 100K
SYMBOL res 2112 -352 R90
WINDOW 0 0 56 VBottom 2
WINDOW 3 32 56 VTop 2
SYMATTR InstName R37
SYMATTR Value R=(V(mod)*100K+1m)
SYMBOL Opamps\\UniversalOpamp2 2624 -320 R0
SYMATTR InstName U14
SYMBOL res 2672 -464 R90
WINDOW 0 0 56 VBottom 2
WINDOW 3 32 56 VTop 2
SYMATTR InstName R52
SYMATTR Value 100K
SYMBOL res 2288 -528 R90
WINDOW 0 0 56 VBottom 2
WINDOW 3 32 56 VTop 2
SYMATTR InstName R53
SYMATTR Value 200K
SYMBOL res 2288 -224 R90
WINDOW 0 0 56 VBottom 2
WINDOW 3 32 56 VTop 2
SYMATTR InstName R54
SYMATTR Value 100K
SYMBOL voltage 1440 928 R0
WINDOW 123 0 0 Left 2
WINDOW 39 0 0 Left 2
SYMATTR InstName V5
SYMATTR Value PULSE(0 0 0 0 0 0)
SYMBOL Opamps\\UniversalOpamp2 1584 -208 R0
SYMATTR InstName U15
SYMBOL res 1632 -352 R90
WINDOW 0 0 56 VBottom 2
WINDOW 3 32 56 VTop 2
SYMATTR InstName R56
SYMATTR Value 100K
SYMBOL res 1488 -240 R90
WINDOW 0 0 56 VBottom 2
WINDOW 3 32 56 VTop 2
SYMATTR InstName R57
SYMATTR Value 100K
SYMBOL memristor_with_state -1088 -784 R270
WINDOW 3 -56 -110 VRight 0
SYMATTR Value Ron=50k Roff=150k Voff=1 Von=1 TAU=0.0001
SYMATTR SpiceModel MEM_KNOWM
SYMATTR InstName U16
SYMBOL res -752 1136 R90
WINDOW 0 0 56 VBottom 2
WINDOW 3 32 56 VTop 2
SYMATTR InstName R60
SYMATTR Value 10K
SYMBOL Opamps\\UniversalOpamp2 -240 1104 R0
SYMATTR InstName U18
SYMBOL diode -352 1104 R270
WINDOW 0 32 32 VTop 2
WINDOW 3 0 32 Invisible 2
SYMATTR InstName D8
SYMBOL diode -352 1136 R270
WINDOW 0 -33 36 VTop 2
WINDOW 3 0 32 Invisible 2
SYMATTR InstName D9
SYMBOL res -208 1088 R0
SYMATTR InstName R61
SYMATTR Value 0.1Meg
SYMBOL res -176 1280 R180
WINDOW 0 45 74 Left 2
WINDOW 3 36 40 Left 2
SYMATTR InstName R62
SYMATTR Value 500K
SYMBOL res -384 1104 R0
WINDOW 0 45 129 Left 2
WINDOW 3 30 155 Left 2
SYMATTR InstName R63
SYMATTR Value 100K
SYMBOL res -176 976 R90
WINDOW 0 0 56 VBottom 2
WINDOW 3 32 56 VTop 2
SYMATTR InstName R64
SYMATTR Value 150K
SYMBOL cap -288 976 R90
WINDOW 0 0 32 VBottom 2
WINDOW 3 32 32 VTop 2
SYMATTR InstName C9
SYMATTR Value 12n
SYMBOL cap -384 1104 R90
WINDOW 0 0 32 VBottom 2
WINDOW 3 32 32 VTop 2
SYMATTR InstName C10
SYMATTR Value 0.01µ
SYMBOL Opamps\\UniversalOpamp2 -688 1136 R0
SYMATTR InstName U19
SYMBOL cap -832 1296 R180
WINDOW 0 24 56 Left 2
WINDOW 3 24 8 Left 2
SYMATTR InstName C11
SYMATTR Value 0.47µ
SYMBOL res -624 1024 R90
WINDOW 0 0 56 VBottom 2
WINDOW 3 32 56 VTop 2
SYMATTR InstName R65
SYMATTR Value 150K
SYMBOL res -720 1056 R180
WINDOW 0 36 76 Left 2
WINDOW 3 36 40 Left 2
SYMATTR InstName R66
SYMATTR Value 150K
SYMBOL Misc\\signal -2080 1200 R0
WINDOW 0 24 16 Invisible 2
WINDOW 3 -259 80 Left 2
WINDOW 123 0 0 Left 2
WINDOW 39 0 0 Left 2
SYMATTR InstName V8
SYMATTR Value PULSE(0 0.5 0 1n 1n 3m 20.1m)
SYMBOL Opamps\\UniversalOpamp2 -512 1120 R0
SYMATTR InstName U20
SYMBOL Opamps\\UniversalOpamp2 48 1088 R0
SYMATTR InstName U21
SYMBOL diode -64 1088 R270
WINDOW 0 32 32 VTop 2
WINDOW 3 0 32 Invisible 2
SYMATTR InstName D10
SYMBOL diode -64 1120 R270
WINDOW 0 -33 36 VTop 2
WINDOW 3 0 32 Invisible 2
SYMATTR InstName D11
SYMBOL res 80 1072 R0
SYMATTR InstName R67
SYMATTR Value 0.1Meg
SYMBOL res 112 1264 R180
WINDOW 0 45 74 Left 2
WINDOW 3 36 40 Left 2
SYMATTR InstName R68
SYMATTR Value 500K
SYMBOL res -80 1088 R0
WINDOW 0 34 121 Left 2
WINDOW 3 30 155 Left 2
SYMATTR InstName R69
SYMATTR Value 100K
SYMBOL res 112 960 R90
WINDOW 0 0 56 VBottom 2
WINDOW 3 32 56 VTop 2
SYMATTR InstName R70
SYMATTR Value 75K
SYMBOL cap 0 960 R90
WINDOW 0 0 32 VBottom 2
WINDOW 3 32 32 VTop 2
SYMATTR InstName C12
SYMATTR Value 22n
SYMBOL cap -64 1088 R90
WINDOW 0 0 32 VBottom 2
WINDOW 3 32 32 VTop 2
SYMATTR InstName C13
SYMATTR Value 0.001µ
SYMBOL diode 128 1104 R270
WINDOW 0 32 32 VTop 2
WINDOW 3 0 32 VBottom 2
SYMATTR InstName D12
SYMBOL res 288 1072 R90
WINDOW 0 0 56 VBottom 2
WINDOW 3 32 56 VTop 2
SYMATTR InstName R72
SYMATTR Value 12K
SYMBOL res 288 1184 R180
WINDOW 0 36 76 Left 2
WINDOW 3 36 40 Left 2
SYMATTR InstName R73
SYMATTR Value 25K
SYMBOL res -640 1216 R90
WINDOW 0 0 56 VBottom 2
WINDOW 3 32 56 VTop 2
SYMATTR InstName R74
SYMATTR Value 240K
SYMBOL Misc\\signal -592 1152 R0
WINDOW 0 24 16 Invisible 2
WINDOW 3 0 56 Center 2
WINDOW 123 0 0 Left 2
WINDOW 39 0 0 Left 2
SYMATTR InstName V9
SYMATTR Value 1
SYMBOL res -1232 1152 R90
WINDOW 0 0 56 VBottom 2
WINDOW 3 32 56 VTop 2
SYMATTR InstName R77
SYMATTR Value 100K
SYMBOL Memristive_brain\\ADG1236 -2256 -464 R0
SYMATTR InstName U17
SYMBOL voltage -2096 272 R0
WINDOW 123 0 0 Left 2
WINDOW 39 0 0 Left 2
SYMATTR InstName V6
SYMATTR Value 15
SYMBOL voltage -1968 384 R180
WINDOW 0 24 96 Left 2
WINDOW 3 24 16 Left 2
WINDOW 123 0 0 Left 2
WINDOW 39 0 0 Left 2
SYMATTR InstName V7
SYMATTR Value 15
SYMBOL Opamps\\UniversalOpamp2 -1200 -208 R0
SYMATTR InstName U23
SYMBOL res -1264 -464 R90
WINDOW 0 0 56 VBottom 2
WINDOW 3 32 56 VTop 2
SYMATTR InstName R80
SYMATTR Value 100K
SYMBOL Opamps\\UniversalOpamp2 -880 -16 R0
SYMATTR InstName U24
SYMBOL res -816 80 R90
WINDOW 0 0 56 VBottom 2
WINDOW 3 32 56 VTop 2
SYMATTR InstName R81
SYMATTR Value 100K
SYMBOL res -960 128 R180
WINDOW 0 36 76 Left 2
WINDOW 3 36 40 Left 2
SYMATTR InstName R82
SYMATTR Value 10K
SYMBOL res -1072 -464 R90
WINDOW 0 0 56 VBottom 2
WINDOW 3 32 56 VTop 2
SYMATTR InstName R55
SYMATTR Value 100K
SYMBOL Opamps\\UniversalOpamp2 -1056 1152 R0
SYMATTR InstName U22
SYMBOL res -1008 1024 R90
WINDOW 0 0 56 VBottom 2
WINDOW 3 32 56 VTop 2
SYMATTR InstName R58
SYMATTR Value 200K
SYMBOL Opamps\\UniversalOpamp2 672 2064 R0
SYMATTR InstName U25
SYMBOL res 720 1936 R90
WINDOW 0 0 56 VBottom 2
WINDOW 3 32 56 VTop 2
SYMATTR InstName R59
SYMATTR Value 300K
SYMBOL res 592 2144 R0
SYMATTR InstName R75
SYMATTR Value 10K
SYMBOL res 624 2064 R90
WINDOW 0 8 128 VBottom 2
WINDOW 3 20 127 VTop 2
SYMATTR InstName R76
SYMATTR Value 100K
SYMBOL Opamps\\UniversalOpamp2 96 2096 R0
SYMATTR InstName U26
SYMBOL cap 64 2256 R180
WINDOW 0 24 56 Left 2
WINDOW 3 24 8 Left 2
SYMATTR InstName C14
SYMATTR Value 0.1µ
SYMBOL res 48 2096 R90
WINDOW 0 0 56 VBottom 2
WINDOW 3 32 56 VTop 2
SYMATTR InstName R78
SYMATTR Value 10K
SYMBOL res 48 2544 R90
WINDOW 0 0 56 VBottom 2
WINDOW 3 32 56 VTop 2
SYMATTR InstName R79
SYMATTR Value 10K
SYMBOL res 160 1984 R90
WINDOW 0 0 56 VBottom 2
WINDOW 3 32 56 VTop 2
SYMATTR InstName R83
SYMATTR Value 10K
SYMBOL res 624 2112 R90
WINDOW 0 40 132 VBottom 2
WINDOW 3 45 130 VTop 2
SYMATTR InstName R84
SYMATTR Value 100K
SYMBOL Opamps\\UniversalOpamp2 320 2080 R0
SYMATTR InstName U27
SYMBOL diode 208 2080 R270
WINDOW 0 32 32 VTop 2
WINDOW 3 0 32 Invisible 2
SYMATTR InstName D13
SYMBOL diode 208 2112 R270
WINDOW 0 -36 37 VTop 2
WINDOW 3 0 32 Invisible 2
SYMATTR InstName D14
SYMBOL res 352 2064 R0
SYMATTR InstName R85
SYMATTR Value 1Meg
SYMBOL res 384 2256 R180
WINDOW 0 58 71 Left 2
WINDOW 3 36 40 Left 2
SYMATTR InstName R86
SYMATTR Value 700K
SYMBOL res 192 2080 R0
WINDOW 0 32 126 Left 2
WINDOW 3 30 158 Left 2
SYMATTR InstName R87
SYMATTR Value 100K
SYMBOL cap 208 2080 R90
WINDOW 0 0 32 VBottom 2
WINDOW 3 32 32 VTop 2
SYMATTR InstName C15
SYMATTR Value 0.001µ
SYMBOL res 384 1952 R90
WINDOW 0 0 56 VBottom 2
WINDOW 3 32 56 VTop 2
SYMATTR InstName R88
SYMATTR Value 22K
SYMBOL cap 272 1952 R90
WINDOW 0 0 32 VBottom 2
WINDOW 3 32 32 VTop 2
SYMATTR InstName C16
SYMATTR Value 100n
SYMBOL res 528 1968 R270
WINDOW 0 32 56 VTop 2
WINDOW 3 0 56 VBottom 2
SYMATTR InstName R89
SYMATTR Value 10K
SYMBOL diode 736 2080 R270
WINDOW 0 32 32 VTop 2
WINDOW 3 0 32 Invisible 2
SYMATTR InstName D15
SYMBOL res 624 2016 R90
WINDOW 0 -24 131 VBottom 2
WINDOW 3 -15 125 VTop 2
SYMATTR InstName R90
SYMATTR Value 100K
SYMBOL Opamps\\UniversalOpamp2 320 2528 R0
SYMATTR InstName U28
SYMBOL diode 208 2528 R270
WINDOW 0 32 32 VTop 2
WINDOW 3 0 32 Invisible 2
SYMATTR InstName D16
SYMBOL diode 208 2560 R270
WINDOW 0 -33 36 VTop 2
WINDOW 3 0 32 Invisible 2
SYMATTR InstName D17
SYMBOL res 352 2512 R0
SYMATTR InstName R91
SYMATTR Value 1Meg
SYMBOL res 384 2704 R180
WINDOW 0 45 74 Left 2
WINDOW 3 36 40 Left 2
SYMATTR InstName R92
SYMATTR Value 700K
SYMBOL res 192 2528 R0
WINDOW 0 34 121 Left 2
WINDOW 3 30 155 Left 2
SYMATTR InstName R93
SYMATTR Value 100K
SYMBOL res 384 2400 R90
WINDOW 0 0 56 VBottom 2
WINDOW 3 32 56 VTop 2
SYMATTR InstName R94
SYMATTR Value 22K
SYMBOL cap 272 2400 R90
WINDOW 0 0 32 VBottom 2
WINDOW 3 32 32 VTop 2
SYMATTR InstName C17
SYMATTR Value 100n
SYMBOL cap 208 2528 R90
WINDOW 0 0 32 VBottom 2
WINDOW 3 32 32 VTop 2
SYMATTR InstName C18
SYMATTR Value 0.001µ
SYMBOL Opamps\\UniversalOpamp2 672 2512 R0
SYMATTR InstName U29
SYMBOL res 720 2384 R90
WINDOW 0 0 56 VBottom 2
WINDOW 3 32 56 VTop 2
SYMATTR InstName R95
SYMATTR Value 300K
SYMBOL res 592 2592 R0
SYMATTR InstName R96
SYMATTR Value 10K
SYMBOL res 624 2512 R90
WINDOW 0 16 130 VBottom 2
WINDOW 3 25 129 VTop 2
SYMATTR InstName R97
SYMATTR Value 100K
SYMBOL res 624 2560 R90
WINDOW 0 55 133 VBottom 2
WINDOW 3 68 132 VTop 2
SYMATTR InstName R98
SYMATTR Value 100K
SYMBOL res 528 2416 R270
WINDOW 0 32 56 VTop 2
WINDOW 3 0 56 VBottom 2
SYMATTR InstName R99
SYMATTR Value 10K
SYMBOL diode 736 2528 R270
WINDOW 0 32 32 VTop 2
WINDOW 3 0 32 Invisible 2
SYMATTR InstName D18
SYMBOL res 624 2464 R90
WINDOW 0 -19 133 VBottom 2
WINDOW 3 -9 132 VTop 2
SYMATTR InstName R100
SYMATTR Value 100K
SYMBOL res 1024 1920 R90
WINDOW 0 0 56 VBottom 2
WINDOW 3 32 56 VTop 2
SYMATTR InstName R101
SYMATTR Value 30K
SYMBOL res 896 2048 R90
WINDOW 0 0 56 VBottom 2
WINDOW 3 32 56 VTop 2
SYMATTR InstName R102
SYMATTR Value 15K
SYMBOL res 896 2208 R180
WINDOW 0 36 76 Left 2
WINDOW 3 43 40 Left 2
SYMATTR InstName R103
SYMATTR Value 15K
SYMBOL res 160 2176 R90
WINDOW 0 0 56 VBottom 2
WINDOW 3 32 56 VTop 2
SYMATTR InstName R104
SYMATTR Value 1Meg
SYMBOL res 64 1984 R90
WINDOW 0 0 56 VBottom 2
WINDOW 3 32 56 VTop 2
SYMATTR InstName R105
SYMATTR Value 1Meg
SYMBOL Opamps\\UniversalOpamp2 96 2544 R0
SYMATTR InstName U30
SYMBOL cap 64 2704 R180
WINDOW 0 24 56 Left 2
WINDOW 3 24 8 Left 2
SYMATTR InstName C19
SYMATTR Value 0.1µ
SYMBOL res 160 2432 R90
WINDOW 0 0 56 VBottom 2
WINDOW 3 32 56 VTop 2
SYMATTR InstName R106
SYMATTR Value 10K
SYMBOL res 160 2624 R90
WINDOW 0 0 56 VBottom 2
WINDOW 3 32 56 VTop 2
SYMATTR InstName R107
SYMATTR Value 1Meg
SYMBOL res 64 2432 R90
WINDOW 0 0 56 VBottom 2
WINDOW 3 32 56 VTop 2
SYMATTR InstName R108
SYMATTR Value 1Meg
SYMBOL Opamps\\UniversalOpamp2 960 2080 R0
SYMATTR InstName U31
SYMBOL res 1024 2384 R90
WINDOW 0 0 56 VBottom 2
WINDOW 3 32 56 VTop 2
SYMATTR InstName R109
SYMATTR Value 10K
SYMBOL Opamps\\UniversalOpamp2 960 2528 R0
SYMATTR InstName U32
SYMBOL res 896 2496 R90
WINDOW 0 0 56 VBottom 2
WINDOW 3 32 56 VTop 2
SYMATTR InstName R110
SYMATTR Value 10K
SYMBOL cap 992 1984 R90
WINDOW 0 -4 -60 VBottom 2
WINDOW 3 2 -70 VTop 2
SYMATTR InstName C20
SYMATTR Value 0.047µ
SYMBOL Opamps\\UniversalOpamp2 336 1648 R0
SYMATTR InstName U33
SYMBOL res 384 1520 R90
WINDOW 0 0 56 VBottom 2
WINDOW 3 32 56 VTop 2
SYMATTR InstName R111
SYMATTR Value 150K
SYMBOL res 256 1696 R0
SYMATTR InstName R112
SYMATTR Value 10K
SYMBOL res 288 1648 R90
WINDOW 0 12 120 VBottom 2
WINDOW 3 23 117 VTop 2
SYMATTR InstName R113
SYMATTR Value 100K
SYMBOL res 192 1552 R270
WINDOW 0 85 55 VTop 2
WINDOW 3 76 50 VBottom 2
SYMATTR InstName R114
SYMATTR Value 10K
SYMBOL res 288 1600 R90
WINDOW 0 -21 45 VBottom 2
WINDOW 3 -21 41 VTop 2
SYMATTR InstName R115
SYMATTR Value 100K
SYMBOL res 112 1520 R0
SYMATTR InstName R116
SYMATTR Value 100K
SYMBOL res 128 1600 R90
WINDOW 0 0 56 VBottom 2
WINDOW 3 32 56 VTop 2
SYMATTR InstName R117
SYMATTR Value 50K
SYMBOL diode 400 1664 R270
WINDOW 0 32 32 VTop 2
WINDOW 3 0 32 Invisible 2
SYMATTR InstName D19
SYMBOL res 736 1488 R90
WINDOW 0 0 56 VBottom 2
WINDOW 3 32 56 VTop 2
SYMATTR InstName R118
SYMATTR Value 120K
SYMBOL Opamps\\UniversalOpamp2 672 1632 R0
SYMATTR InstName U34
SYMBOL res 640 1600 R90
WINDOW 0 -53 52 VBottom 2
WINDOW 3 -42 52 VTop 2
SYMATTR InstName R119
SYMATTR Value 100K
SYMBOL res 640 1632 R90
WINDOW 0 76 58 VBottom 2
WINDOW 3 87 57 VTop 2
SYMATTR InstName R120
SYMATTR Value 100K
SYMBOL npn 624 1840 R270
WINDOW 0 56 32 VRight 2
WINDOW 3 56 68 Invisible 2
SYMATTR InstName Q1
SYMBOL res 1024 1488 R90
WINDOW 0 0 56 VBottom 2
WINDOW 3 60 56 VBottom 2
SYMATTR InstName R121
SYMATTR Value 35K
SYMBOL res 896 1616 R90
WINDOW 0 0 56 VBottom 2
WINDOW 3 32 56 VTop 2
SYMATTR InstName R122
SYMATTR Value 15K
SYMBOL res 896 1808 R180
WINDOW 0 36 76 Left 2
WINDOW 3 36 40 Left 2
SYMATTR InstName R123
SYMATTR Value 15K
SYMBOL Opamps\\UniversalOpamp2 960 1648 R0
SYMATTR InstName U35
SYMBOL cap 992 1552 R90
WINDOW 0 8 -66 VBottom 2
WINDOW 3 11 -75 VTop 2
SYMATTR InstName C21
SYMATTR Value 0.047µ
SYMBOL res 896 1856 R270
WINDOW 0 32 56 VTop 2
WINDOW 3 0 56 VBottom 2
SYMATTR InstName R124
SYMATTR Value 1K
SYMBOL res 288 1696 R90
WINDOW 0 51 117 VBottom 2
WINDOW 3 61 116 VTop 2
SYMATTR InstName R125
SYMATTR Value 100K
SYMBOL Opamps\\UniversalOpamp2 1952 1584 R0
SYMATTR InstName U36
SYMBOL Opamps\\UniversalOpamp2 1920 1888 R0
SYMATTR InstName U37
SYMBOL res 2000 1440 R90
WINDOW 0 0 56 VBottom 2
WINDOW 3 32 56 VTop 2
SYMATTR InstName R126
SYMATTR Value R=((1-V(mod))*100K+1m)
SYMBOL res 1856 1552 R90
WINDOW 0 0 56 VBottom 2
WINDOW 3 32 56 VTop 2
SYMATTR InstName R127
SYMATTR Value 100K
SYMBOL res 1856 1856 R90
WINDOW 0 0 56 VBottom 2
WINDOW 3 32 56 VTop 2
SYMATTR InstName R128
SYMATTR Value 100K
SYMBOL res 1984 1744 R90
WINDOW 0 0 56 VBottom 2
WINDOW 3 32 56 VTop 2
SYMATTR InstName R129
SYMATTR Value R=(V(mod)*100K+1m)
SYMBOL Opamps\\UniversalOpamp2 2496 1776 R0
SYMATTR InstName U38
SYMBOL res 2544 1632 R90
WINDOW 0 0 56 VBottom 2
WINDOW 3 32 56 VTop 2
SYMATTR InstName R130
SYMATTR Value 100K
SYMBOL res 2160 1568 R90
WINDOW 0 0 56 VBottom 2
WINDOW 3 32 56 VTop 2
SYMATTR InstName R131
SYMATTR Value 200K
SYMBOL res 2160 1872 R90
WINDOW 0 0 56 VBottom 2
WINDOW 3 32 56 VTop 2
SYMATTR InstName R132
SYMATTR Value 100K
SYMBOL Opamps\\UniversalOpamp2 1456 1888 R0
SYMATTR InstName U39
SYMBOL res 1504 1744 R90
WINDOW 0 0 56 VBottom 2
WINDOW 3 32 56 VTop 2
SYMATTR InstName R133
SYMATTR Value 100K
SYMBOL res 1360 1856 R90
WINDOW 0 0 56 VBottom 2
WINDOW 3 32 56 VTop 2
SYMATTR InstName R134
SYMATTR Value 100K
SYMBOL Misc\\signal -1648 1200 R0
WINDOW 0 24 16 Invisible 2
WINDOW 3 -259 80 Left 2
WINDOW 123 0 0 Left 2
WINDOW 39 0 0 Left 2
SYMATTR InstName V3
SYMATTR Value PULSE(0 0.5 0 1n 1n 3m 20m)
SYMBOL Opamps\\UniversalOpamp2 -1344 1840 R0
SYMATTR InstName U40
SYMBOL res -1408 1584 R90
WINDOW 0 0 56 VBottom 2
WINDOW 3 32 56 VTop 2
SYMATTR InstName R135
SYMATTR Value 100K
SYMBOL Opamps\\UniversalOpamp2 -1024 2032 R0
SYMATTR InstName U41
SYMBOL res -960 2128 R90
WINDOW 0 0 56 VBottom 2
WINDOW 3 32 56 VTop 2
SYMATTR InstName R136
SYMATTR Value 1Meg
SYMBOL res -1104 2176 R180
WINDOW 0 36 76 Left 2
WINDOW 3 36 40 Left 2
SYMATTR InstName R137
SYMATTR Value 10K
SYMBOL res -1216 1584 R90
WINDOW 0 0 56 VBottom 2
WINDOW 3 32 56 VTop 2
SYMATTR InstName R138
SYMATTR Value 100K
SYMBOL res -1232 1248 R90
WINDOW 0 0 56 VBottom 2
WINDOW 3 32 56 VTop 2
SYMATTR InstName R139
SYMATTR Value 100K
SYMBOL res -1168 1152 R0
SYMATTR InstName R140
SYMATTR Value 100K
SYMBOL res -1168 1024 R90
WINDOW 0 0 56 VBottom 2
WINDOW 3 32 56 VTop 2
SYMATTR InstName R141
SYMATTR Value 100K
SYMBOL res -816 1392 R90
WINDOW 0 0 56 VBottom 2
WINDOW 3 32 56 VTop 2
SYMATTR InstName R142
SYMATTR Value 100K
SYMBOL npn -800 1360 R0
WINDOW 0 56 39 VRight 2
WINDOW 3 56 68 Invisible 2
SYMATTR InstName Q3
TEXT -1912 1032 Left 2 !.tran 0 2 0 1000u

The netlist it stands for:
* combined_schematicV2.asc
XU3 N030 N028 +5 -5 N025 level.2 Avol=1Meg GBW=10Meg Slew=10Meg ilimit=25m rail=0 Vos=0 phimargin=45 en=0 enk=0 in=0 ink=0 Rin=500Meg  ; pins IN+ IN- V+ V- OUT
R14 N025 N028 300K
R12 N030 0 10K
R10 N030 N029 100K
XU1 N034 N027 +5 -5 N016 level.2 Avol=1Meg GBW=10Meg Slew=10Meg ilimit=25m rail=0 Vos=0 phimargin=45 en=0 enk=0 in=0 ink=0 Rin=500Meg  ; pins IN+ IN- V+ V- OUT
C1 0 N034 0.1µ
R1 N034 Tpre 10K
R15 N045 LeakOut 10K
R3 N016 N027 10K
R11 N030 N018 100K
XU2 N033 N026 +5 -5 N029 level.2 Avol=1Meg GBW=10Meg Slew=10Meg ilimit=25m rail=0 Vos=0 phimargin=45 en=0 enk=0 in=0 ink=0 Rin=500Meg  ; pins IN+ IN- V+ V- OUT
D1 0 N026 D
D2 N032 N033 D
R7 N029 N033 1Meg
R8 0 N033 700K
R5 N032 0 100K
C2 N032 N016 0.0068µ
R6 N029 N026 22K
C3 N026 0 100n
R13 0 N028 10K
D3 N025 P001 D
R9 N030 -5 100K
XU5 N044 N038 +5 -5 N041 level.2 Avol=1Meg GBW=10Meg Slew=10Meg ilimit=25m rail=0 Vos=0 phimargin=45 en=0 enk=0 in=0 ink=0 Rin=500Meg  ; pins IN+ IN- V+ V- OUT
D4 0 N038 D
D5 N043 N044 D
R21 N041 N044 1Meg
R22 0 N044 700K
R19 N043 0 100K
R20 N041 N038 22K
C6 N038 0 100n
C5 N043 N018 0.001µ
XU6 N042 N040 +5 -5 N036 level.2 Avol=1Meg GBW=10Meg Slew=10Meg ilimit=25m rail=0 Vos=0 phimargin=45 en=0 enk=0 in=0 ink=0 Rin=500Meg  ; pins IN+ IN- V+ V- OUT
R28 N036 N040 300K
R26 N042 0 10K
R24 N042 N041 100K
R25 N042 N016 100K
R27 0 N040 10K
D6 N036 P002 D
R23 N042 -5 100K
R33 Sine N024 30K
R31 N024 P001 15K
R32 N035 N024 15K
R4 N016 N034 1Meg
R2 N027 0 1Meg
XU4 N045 N039 +5 -5 N018 level.2 Avol=1Meg GBW=10Meg Slew=10Meg ilimit=25m rail=0 Vos=0 phimargin=45 en=0 enk=0 in=0 ink=0 Rin=500Meg  ; pins IN+ IN- V+ V- OUT
C4 0 N045 0.1µ
R17 N018 N039 10K
R18 N018 N045 1Meg
R16 N039 0 1Meg
XU8 0 N024 +5 -5 Sine level.2 Avol=1Meg GBW=10Meg Slew=10Meg ilimit=25m rail=0 Vos=0 phimargin=45 en=0 enk=0 in=0 ink=0 Rin=500Meg  ; pins IN+ IN- V+ V- OUT
R30 N035 N037 10K
XU7 0 N037 +5 -5 N035 level.2 Avol=1Meg GBW=10Meg Slew=10Meg ilimit=25m rail=0 Vos=0 phimargin=45 en=0 enk=0 in=0 ink=0 Rin=500Meg  ; pins IN+ IN- V+ V- OUT
R29 N037 P002 10K
C7 Sine N024 0.047µ
XU9 N017 N011 +5 -5 N008 level.2 Avol=1Meg GBW=10Meg Slew=10Meg ilimit=25m rail=0 Vos=0 phimargin=45 en=0 enk=0 in=0 ink=0 Rin=500Meg  ; pins IN+ IN- V+ V- OUT
R45 N008 N011 150K
R43 N017 0 10K
R41 N017 N016 100K
R44 0 N011 10K
R40 N017 N010 100K
R39 0 N010 100K
R38 N010 -5 50K
D7 N008 Sombrero D
R48 N012 N006 120K
XU10 N015 N006 +5 -5 N012 level.2 Avol=1Meg GBW=10Meg Slew=10Meg ilimit=25m rail=0 Vos=0 phimargin=45 en=0 enk=0 in=0 ink=0 Rin=500Meg  ; pins IN+ IN- V+ V- OUT
R46 N006 Sombrero 100K
R47 N015 Sombrero 100K
Q2 N015 N023 0 0 NPN
R51 Hebbian N007 35K
R49 N007 N012 15K
R50 0 N007 15K
XU11 0 N007 +5 -5 Hebbian level.2 Avol=1Meg GBW=10Meg Slew=10Meg ilimit=25m rail=0 Vos=0 phimargin=45 en=0 enk=0 in=0 ink=0 Rin=500Meg  ; pins IN+ IN- V+ V- OUT
C8 Hebbian N007 0.047µ
R71 N023 Sine 1K
V1 +5 0 5
V2 0 -5 5
R42 N017 N018 100K
XU12 0 N004 +5 -5 N005 level.2 Avol=1Meg GBW=10Meg Slew=10Meg ilimit=25m rail=0 Vos=0 phimargin=45 en=0 enk=0 in=0 ink=0 Rin=500Meg  ; pins IN+ IN- V+ V- OUT
XU13 0 N021 +5 -5 N022 level.2 Avol=1Meg GBW=10Meg Slew=10Meg ilimit=25m rail=0 Vos=0 phimargin=45 en=0 enk=0 in=0 ink=0 Rin=500Meg  ; pins IN+ IN- V+ V- OUT
R34 N005 N004 R=((1-V(mod))*100K+1m)
R35 N004 Sombrero 100K
R36 N021 N020 100K
R37 N022 N021 R=(V(mod)*100K+1m)
XU14 0 N009 +5 -5 LearnOut level.2 Avol=1Meg GBW=10Meg Slew=10Meg ilimit=25m rail=0 Vos=0 phimargin=45 en=0 enk=0 in=0 ink=0 Rin=500Meg  ; pins IN+ IN- V+ V- OUT
R52 LearnOut N009 100K
R53 N009 N005 200K
R54 N009 N022 100K
V5 mod 0 PULSE(0 0 0 0 0 0)
XU15 0 N019 +5 -5 N020 level.2 Avol=1Meg GBW=10Meg Slew=10Meg ilimit=25m rail=0 Vos=0 phimargin=45 en=0 enk=0 in=0 ink=0 Rin=500Meg  ; pins IN+ IN- V+ V- OUT
R56 N020 N019 100K
R57 N019 Hebbian 100K
XU16 N001 N001 N001 MEM_KNOWM Ron=50k Roff=150k Voff=1 Von=1 TAU=0.0001  ; pins TE BE xsv
R60 N058 N049 10K
XU18 N056 N047 +5 -5 barrier level.2 Avol=1Meg GBW=10Meg Slew=10Meg ilimit=25m rail=0 Vos=0 phimargin=45 en=0 enk=0 in=0 ink=0 Rin=500Meg  ; pins IN+ IN- V+ V- OUT
D8 0 N047 D
D9 N055 N056 D
R61 barrier N056 0.1Meg
R62 0 N056 500K
R63 N055 0 100K
R64 barrier N047 150K
C9 N047 0 12n
C10 N055 N054 0.01µ
XU19 N058 N050 +5 -5 N057 level.2 Avol=1Meg GBW=10Meg Slew=10Meg ilimit=25m rail=0 Vos=0 phimargin=45 en=0 enk=0 in=0 ink=0 Rin=500Meg  ; pins IN+ IN- V+ V- OUT
C11 0 N058 0.47µ
R65 N057 N050 150K
R66 N050 0 150K
V8 InSpike 0 PULSE(0 0.5 0 1n 1n 3m 20.1m)
XU20 N057 N052 +5 -5 N054 level.2 Avol=1Meg GBW=10Meg Slew=10Meg ilimit=25m rail=0 Vos=0 phimargin=45 en=0 enk=0 in=0 ink=0 Rin=500Meg  ; pins IN+ IN- V+ V- OUT
XU21 N053 N046 +5 -5 N051 level.2 Avol=1Meg GBW=10Meg Slew=10Meg ilimit=25m rail=0 Vos=0 phimargin=45 en=0 enk=0 in=0 ink=0 Rin=500Meg  ; pins IN+ IN- V+ V- OUT
D10 0 N046 D
D11 P003 N053 D
R67 N051 N053 0.1Meg
R68 0 N053 500K
R69 P003 0 100K
R70 N051 N046 75K
C12 N046 0 22n
C13 P003 barrier 0.001µ
D12 N051 P004 D
R72 LeakOut P004 12K
R73 0 LeakOut 25K
R74 N057 N058 240K
V9 N052 0 1
R77 N059 Tpre 100K
XU17 ctrl N013 N002 LearnOut -15 0 ctrl NC_01 N003 0 +15 ADG1236  ; pins IN1 S1A D1 S1B VSS GND IN2 S2A D2 S2B VDD
V6 +15 0 15
V7 0 -15 15
XU23 InSpike N014 +5 -5 Tpre level.2 Avol=1Meg GBW=10Meg Slew=10Meg ilimit=25m rail=0 Vos=0 phimargin=45 en=0 enk=0 in=0 ink=0 Rin=500Meg  ; pins IN+ IN- V+ V- OUT
R80 N014 0 100K
XU24 N031 LearnOut +5 -5 ctrl level.2 Avol=1Meg GBW=10Meg Slew=10Meg ilimit=25m rail=0 Vos=0 phimargin=45 en=0 enk=0 in=0 ink=0 Rin=500Meg  ; pins IN+ IN- V+ V- OUT
R81 ctrl N031 100K
R82 0 N031 10K
R55 Tpre N014 100K
XU22 N059 N048 +5 -5 N049 level.2 Avol=1Meg GBW=10Meg Slew=10Meg ilimit=25m rail=0 Vos=0 phimargin=45 en=0 enk=0 in=0 ink=0 Rin=500Meg  ; pins IN+ IN- V+ V- OUT
R58 N049 N048 200K
XU25 N087 N085 +5 -5 N081 level.2 Avol=1Meg GBW=10Meg Slew=10Meg ilimit=25m rail=0 Vos=0 phimargin=45 en=0 enk=0 in=0 ink=0 Rin=500Meg  ; pins IN+ IN- V+ V- OUT
R59 N081 N085 300K
R75 N087 0 10K
R76 N087 N086 100K
XU26 N089 N083 +5 -5 N072 level.2 Avol=1Meg GBW=10Meg Slew=10Meg ilimit=25m rail=0 Vos=0 phimargin=45 en=0 enk=0 in=0 ink=0 Rin=500Meg  ; pins IN+ IN- V+ V- OUT
C14 0 N089 0.1µ
R78 N089 Tpre1 10K
R79 N099 LeakOut 10K
R83 N072 N083 10K
R84 N087 N074 100K
XU27 N088 N082 +5 -5 N086 level.2 Avol=1Meg GBW=10Meg Slew=10Meg ilimit=25m rail=0 Vos=0 phimargin=45 en=0 enk=0 in=0 ink=0 Rin=500Meg  ; pins IN+ IN- V+ V- OUT
D13 0 N082 D
D14 P005 N088 D
R85 N086 N088 1Meg
R86 0 N088 700K
R87 P005 0 100K
C15 P005 N072 0.001µ
R88 N086 N082 22K
C16 N082 0 100n
R89 0 N085 10K
D15 N081 P006 D
R90 N087 -5 100K
XU28 N098 N093 +5 -5 N096 level.2 Avol=1Meg GBW=10Meg Slew=10Meg ilimit=25m rail=0 Vos=0 phimargin=45 en=0 enk=0 in=0 ink=0 Rin=500Meg  ; pins IN+ IN- V+ V- OUT
D16 0 N093 D
D17 P007 N098 D
R91 N096 N098 1Meg
R92 0 N098 700K
R93 P007 0 100K
R94 N096 N093 22K
C17 N093 0 100n
C18 P007 N074 0.001µ
XU29 N097 N095 +5 -5 N091 level.2 Avol=1Meg GBW=10Meg Slew=10Meg ilimit=25m rail=0 Vos=0 phimargin=45 en=0 enk=0 in=0 ink=0 Rin=500Meg  ; pins IN+ IN- V+ V- OUT
R95 N091 N095 300K
R96 N097 0 10K
R97 N097 N096 100K
R98 N097 N072 100K
R99 0 N095 10K
D18 N091 P008 D
R100 N097 -5 100K
R101 Sine N080 30K
R102 N080 P006 15K
R103 N090 N080 15K
R104 N072 N089 1Meg
R105 N083 0 1Meg
XU30 N099 N094 +5 -5 N074 level.2 Avol=1Meg GBW=10Meg Slew=10Meg ilimit=25m rail=0 Vos=0 phimargin=45 en=0 enk=0 in=0 ink=0 Rin=500Meg  ; pins IN+ IN- V+ V- OUT
C19 0 N099 0.1µ
R106 N074 N094 10K
R107 N074 N099 1Meg
R108 N094 0 1Meg
XU31 0 N080 +5 -5 Sine level.2 Avol=1Meg GBW=10Meg Slew=10Meg ilimit=25m rail=0 Vos=0 phimargin=45 en=0 enk=0 in=0 ink=0 Rin=500Meg  ; pins IN+ IN- V+ V- OUT
R109 N090 N092 10K
XU32 0 N092 +5 -5 N090 level.2 Avol=1Meg GBW=10Meg Slew=10Meg ilimit=25m rail=0 Vos=0 phimargin=45 en=0 enk=0 in=0 ink=0 Rin=500Meg  ; pins IN+ IN- V+ V- OUT
R110 N092 P008 10K
C20 Sine N080 0.047µ
XU33 N073 N069 +5 -5 N065 level.2 Avol=1Meg GBW=10Meg Slew=10Meg ilimit=25m rail=0 Vos=0 phimargin=45 en=0 enk=0 in=0 ink=0 Rin=500Meg  ; pins IN+ IN- V+ V- OUT
R111 N065 N069 150K
R112 N073 0 10K
R113 N073 N072 100K
R114 0 N069 10K
R115 N073 N068 100K
R116 0 N068 100K
R117 N068 -5 50K
D19 N065 Sombrero1 D
R118 N070 N063 120K
XU34 N071 N063 +5 -5 N070 level.2 Avol=1Meg GBW=10Meg Slew=10Meg ilimit=25m rail=0 Vos=0 phimargin=45 en=0 enk=0 in=0 ink=0 Rin=500Meg  ; pins IN+ IN- V+ V- OUT
R119 N063 Sombrero1 100K
R120 N071 Sombrero1 100K
Q1 N071 N079 0 0 NPN
R121 Hebbian1 N064 35K
R122 N064 N070 15K
R123 0 N064 15K
XU35 0 N064 +5 -5 Hebbian1 level.2 Avol=1Meg GBW=10Meg Slew=10Meg ilimit=25m rail=0 Vos=0 phimargin=45 en=0 enk=0 in=0 ink=0 Rin=500Meg  ; pins IN+ IN- V+ V- OUT
C21 Hebbian1 N064 0.047µ
R124 N079 Sine 1K
R125 N073 N074 100K
XU36 0 N061 +5 -5 N062 level.2 Avol=1Meg GBW=10Meg Slew=10Meg ilimit=25m rail=0 Vos=0 phimargin=45 en=0 enk=0 in=0 ink=0 Rin=500Meg  ; pins IN+ IN- V+ V- OUT
XU37 0 N077 +5 -5 N078 level.2 Avol=1Meg GBW=10Meg Slew=10Meg ilimit=25m rail=0 Vos=0 phimargin=45 en=0 enk=0 in=0 ink=0 Rin=500Meg  ; pins IN+ IN- V+ V- OUT
R126 N062 N061 R=((1-V(mod))*100K+1m)
R127 N061 Sombrero1 100K
R128 N077 N076 100K
R129 N078 N077 R=(V(mod)*100K+1m)
XU38 0 N066 +5 -5 LearnOut1 level.2 Avol=1Meg GBW=10Meg Slew=10Meg ilimit=25m rail=0 Vos=0 phimargin=45 en=0 enk=0 in=0 ink=0 Rin=500Meg  ; pins IN+ IN- V+ V- OUT
R130 LearnOut1 N066 100K
R131 N066 N062 200K
R132 N066 N078 100K
XU39 0 N075 +5 -5 N076 level.2 Avol=1Meg GBW=10Meg Slew=10Meg ilimit=25m rail=0 Vos=0 phimargin=45 en=0 enk=0 in=0 ink=0 Rin=500Meg  ; pins IN+ IN- V+ V- OUT
R133 N076 N075 100K
R134 N075 Hebbian1 100K
V3 InSpike1 0 PULSE(0 0.5 0 1n 1n 3m 20m)
XU40 InSpike1 N067 +5 -5 Tpre1 level.2 Avol=1Meg GBW=10Meg Slew=10Meg ilimit=25m rail=0 Vos=0 phimargin=45 en=0 enk=0 in=0 ink=0 Rin=500Meg  ; pins IN+ IN- V+ V- OUT
R135 N067 0 100K
XU41 N084 LearnOut1 +5 -5 ctrl level.2 Avol=1Meg GBW=10Meg Slew=10Meg ilimit=25m rail=0 Vos=0 phimargin=45 en=0 enk=0 in=0 ink=0 Rin=500Meg  ; pins IN+ IN- V+ V- OUT
R136 ctrl N084 1Meg
R137 0 N084 10K
R138 Tpre1 N067 100K
R139 N059 0 100K
R140 N059 0 100K
R141 N048 0 100K
R142 N060 barrier 100K
Q3 N058 N060 0 0 NPN
.model D D
.lib standard.dio
.model NPN NPN
.model PNP PNP
.lib standard.bjt
.tran 0 2 0 1000u
.lib UniversalOpamps2.sub
.lib memristor_with_state.sub
.lib adg1236.cir
.backanno
.end